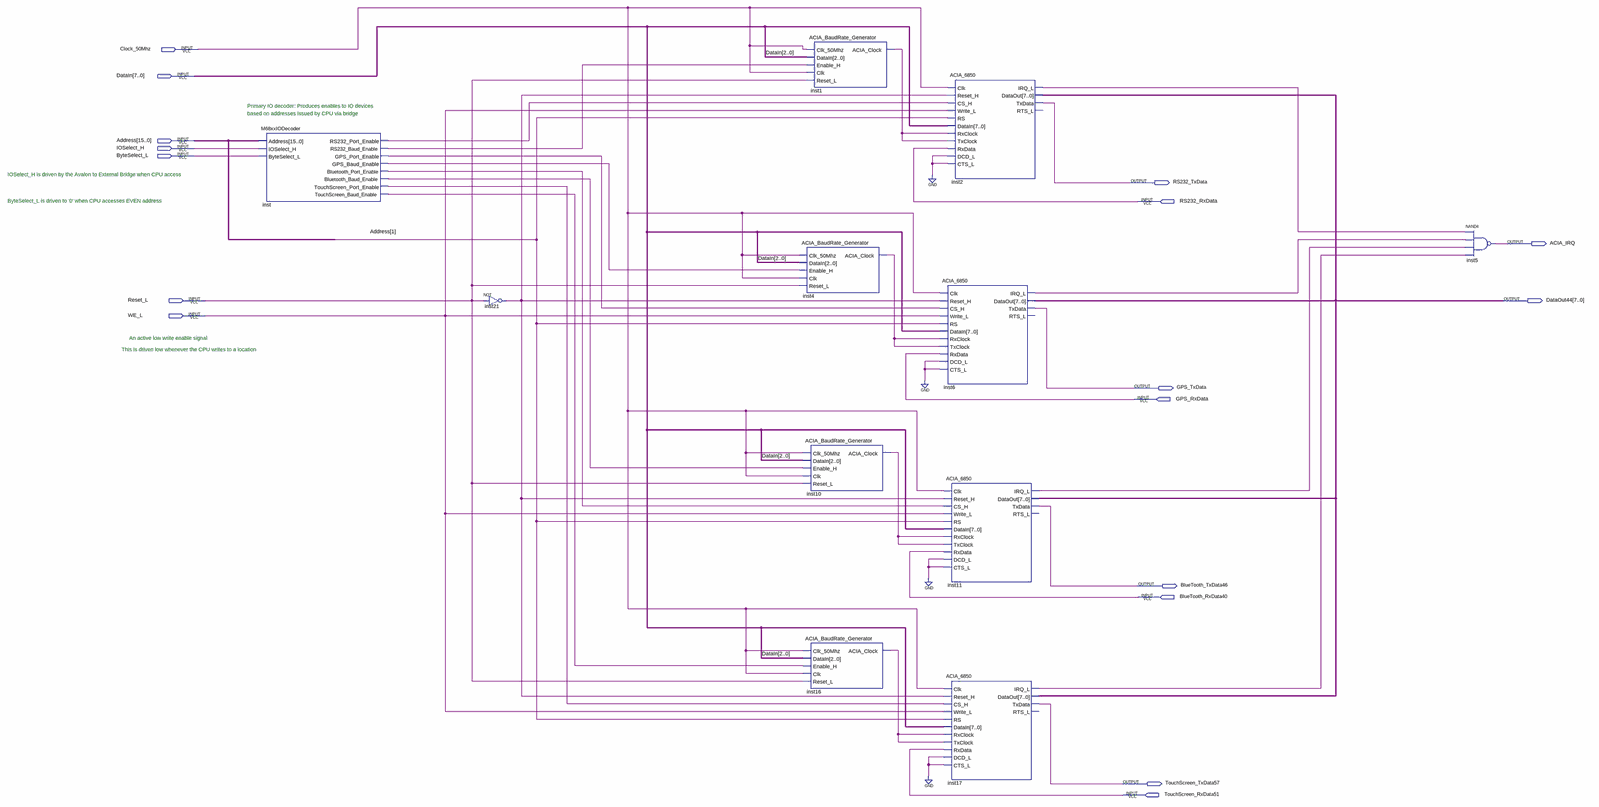
[diagram p0: schematic sheet, whole]
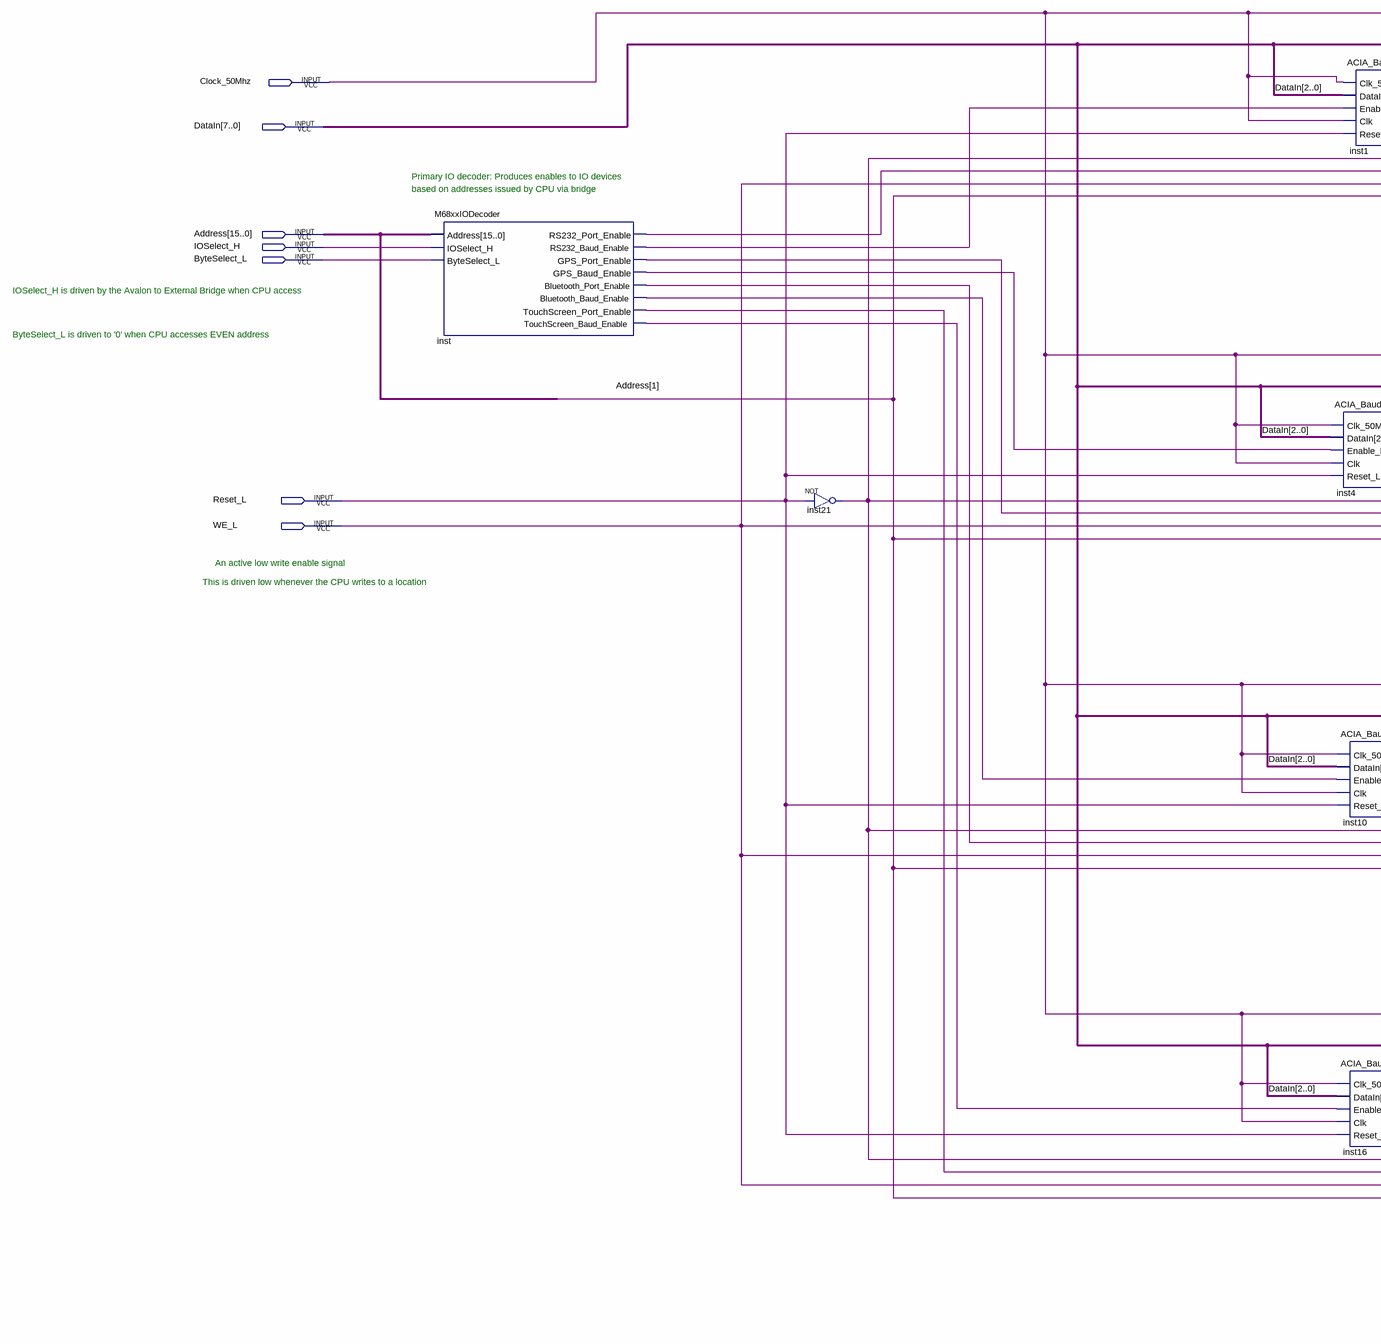
[diagram p1: schematic sheet, left part]
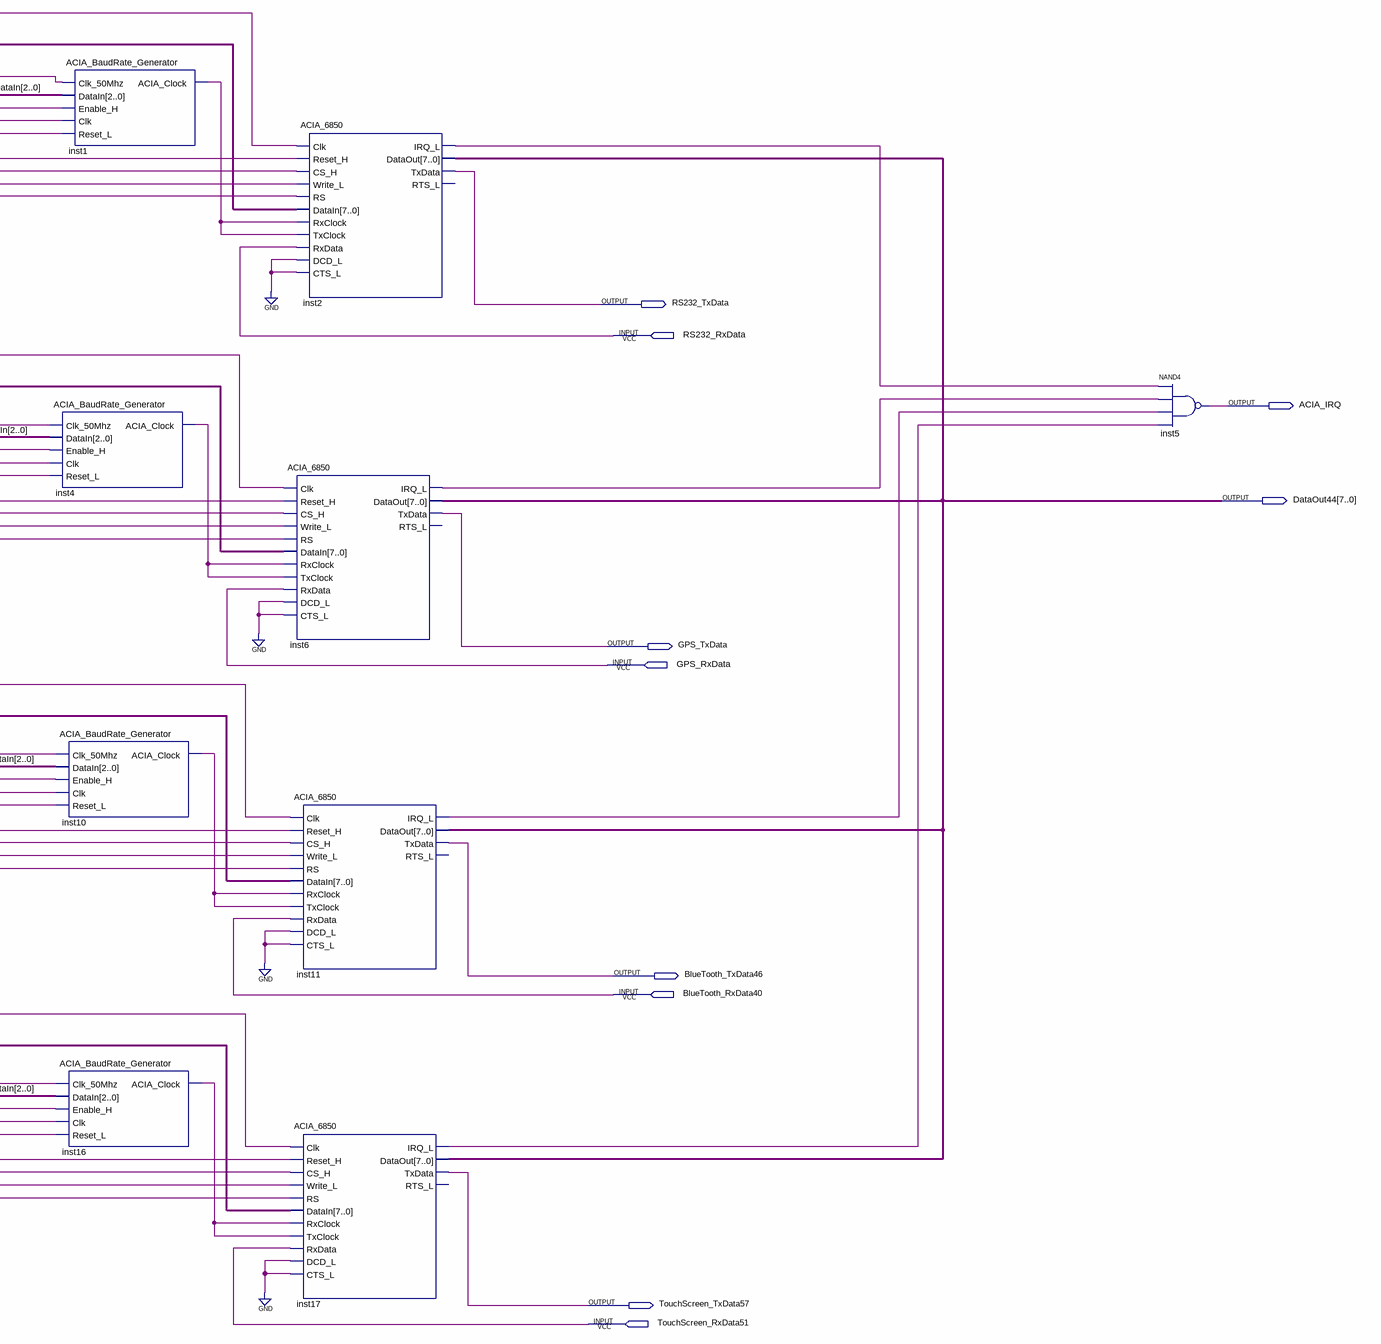
[diagram p2: schematic sheet, right part]
// Quartus schematic OnChipM68xxIO.bdf as structural Verilog: 11 symbols, 17 pins
module OnChipM68xxIO (
  input  Clock_50Mhz,
  input  [7:0] DataIn,
  input  [15:0] Address,
  input  IOSelect_H,
  input  ByteSelect_L,
  input  RS232_RxData,
  input  Reset_L,
  input  WE_L,
  input  GPS_RxData,
  input  BlueTooth_RxData40,
  input  TouchScreen_RxData51,
  output RS232_TxData,
  output ACIA_IRQ,
  output [7:0] DataOut44,
  output GPS_TxData,
  output BlueTooth_TxData46,
  output TouchScreen_TxData57
);

  wire inst1_acia_clock, inst2_irq_l, inst4_acia_clock, inst6_irq_l, inst10_acia_clock, inst11_irq_l,
       inst16_acia_clock, inst17_irq_l, inst21_out, inst_bluetooth_baud_enable, inst_bluetooth_port_enable,
       inst_gps_baud_enable, inst_gps_port_enable, inst_rs232_baud_enable, inst_rs232_port_enable,
       inst_touchscreen_baud_enable, inst_touchscreen_port_enable;

  M68xxIODecoder inst (
    .Address(Address), .IOSelect_H(IOSelect_H), .ByteSelect_L(ByteSelect_L),
    .RS232_Port_Enable(inst_rs232_port_enable), .RS232_Baud_Enable(inst_rs232_baud_enable),
    .GPS_Port_Enable(inst_gps_port_enable), .GPS_Baud_Enable(inst_gps_baud_enable),
    .Bluetooth_Port_Enable(inst_bluetooth_port_enable), .Bluetooth_Baud_Enable(inst_bluetooth_baud_enable),
    .TouchScreen_Port_Enable(inst_touchscreen_port_enable),
    .TouchScreen_Baud_Enable(inst_touchscreen_baud_enable));
  not inst21 (inst21_out, Reset_L);
  ACIA_BaudRate_Generator inst1 (
    .Clk_50Mhz(Clock_50Mhz), .DataIn(DataIn[2:0]), .Enable_H(inst_rs232_baud_enable), .Clk(Clock_50Mhz),
    .Reset_L(Reset_L), .ACIA_Clock(inst1_acia_clock));
  ACIA_BaudRate_Generator inst4 (
    .Clk_50Mhz(Clock_50Mhz), .DataIn(DataIn[2:0]), .Enable_H(inst_gps_baud_enable), .Clk(Clock_50Mhz),
    .Reset_L(Reset_L), .ACIA_Clock(inst4_acia_clock));
  ACIA_BaudRate_Generator inst10 (
    .Clk_50Mhz(Clock_50Mhz), .DataIn(DataIn[2:0]), .Enable_H(inst_bluetooth_baud_enable), .Clk(Clock_50Mhz),
    .Reset_L(Reset_L), .ACIA_Clock(inst10_acia_clock));
  ACIA_BaudRate_Generator inst16 (
    .Clk_50Mhz(Clock_50Mhz), .DataIn(DataIn[2:0]), .Enable_H(inst_touchscreen_baud_enable),
    .Clk(Clock_50Mhz), .Reset_L(Reset_L), .ACIA_Clock(inst16_acia_clock));
  ACIA_6850 inst2 (
    .Clk(Clock_50Mhz), .Reset_H(inst21_out), .CS_H(inst_rs232_port_enable), .Write_L(WE_L), .RS(Address[1]),
    .DataIn(DataIn), .RxClock(inst1_acia_clock), .TxClock(inst1_acia_clock), .RxData(RS232_RxData),
    .DCD_L(1'b0), .CTS_L(1'b0), .IRQ_L(inst2_irq_l), .DataOut(DataOut44), .TxData(RS232_TxData));  // open: RTS_L
  ACIA_6850 inst6 (
    .Clk(Clock_50Mhz), .Reset_H(inst21_out), .CS_H(inst_gps_port_enable), .Write_L(WE_L), .RS(Address[1]),
    .DataIn(DataIn), .RxClock(inst4_acia_clock), .TxClock(inst4_acia_clock), .RxData(GPS_RxData),
    .DCD_L(1'b0), .CTS_L(1'b0), .IRQ_L(inst6_irq_l), .DataOut(DataOut44), .TxData(GPS_TxData));  // open: RTS_L
  ACIA_6850 inst11 (
    .Clk(Clock_50Mhz), .Reset_H(inst21_out), .CS_H(inst_bluetooth_port_enable), .Write_L(WE_L),
    .RS(Address[1]), .DataIn(DataIn), .RxClock(inst10_acia_clock), .TxClock(inst10_acia_clock),
    .RxData(BlueTooth_RxData40), .DCD_L(1'b0), .CTS_L(1'b0), .IRQ_L(inst11_irq_l), .DataOut(DataOut44),
    .TxData(BlueTooth_TxData46));  // open: RTS_L
  ACIA_6850 inst17 (
    .Clk(Clock_50Mhz), .Reset_H(inst21_out), .CS_H(inst_touchscreen_port_enable), .Write_L(WE_L),
    .RS(Address[1]), .DataIn(DataIn), .RxClock(inst16_acia_clock), .TxClock(inst16_acia_clock),
    .RxData(TouchScreen_RxData51), .DCD_L(1'b0), .CTS_L(1'b0), .IRQ_L(inst17_irq_l), .DataOut(DataOut44),
    .TxData(TouchScreen_TxData57));  // open: RTS_L
  nand inst5 (ACIA_IRQ, inst2_irq_l, inst6_irq_l, inst11_irq_l, inst17_irq_l);

  // Notes on the sheet:
  //   Primary IO decoder: Produces enables to IO devices
  //   based on addresses issued by CPU via bridge
  //   IOSelect_H is driven by the Avalon to External Bridge when CPU access
  //   ByteSelect_L is driven to '0' when CPU accesses EVEN address
  //   An active low write enable signal
  //   This is driven low whenever the CPU writes to a location
endmodule
